# EasyEDA Pro project LCD1602 1601转接板.epro

# Board PCB1
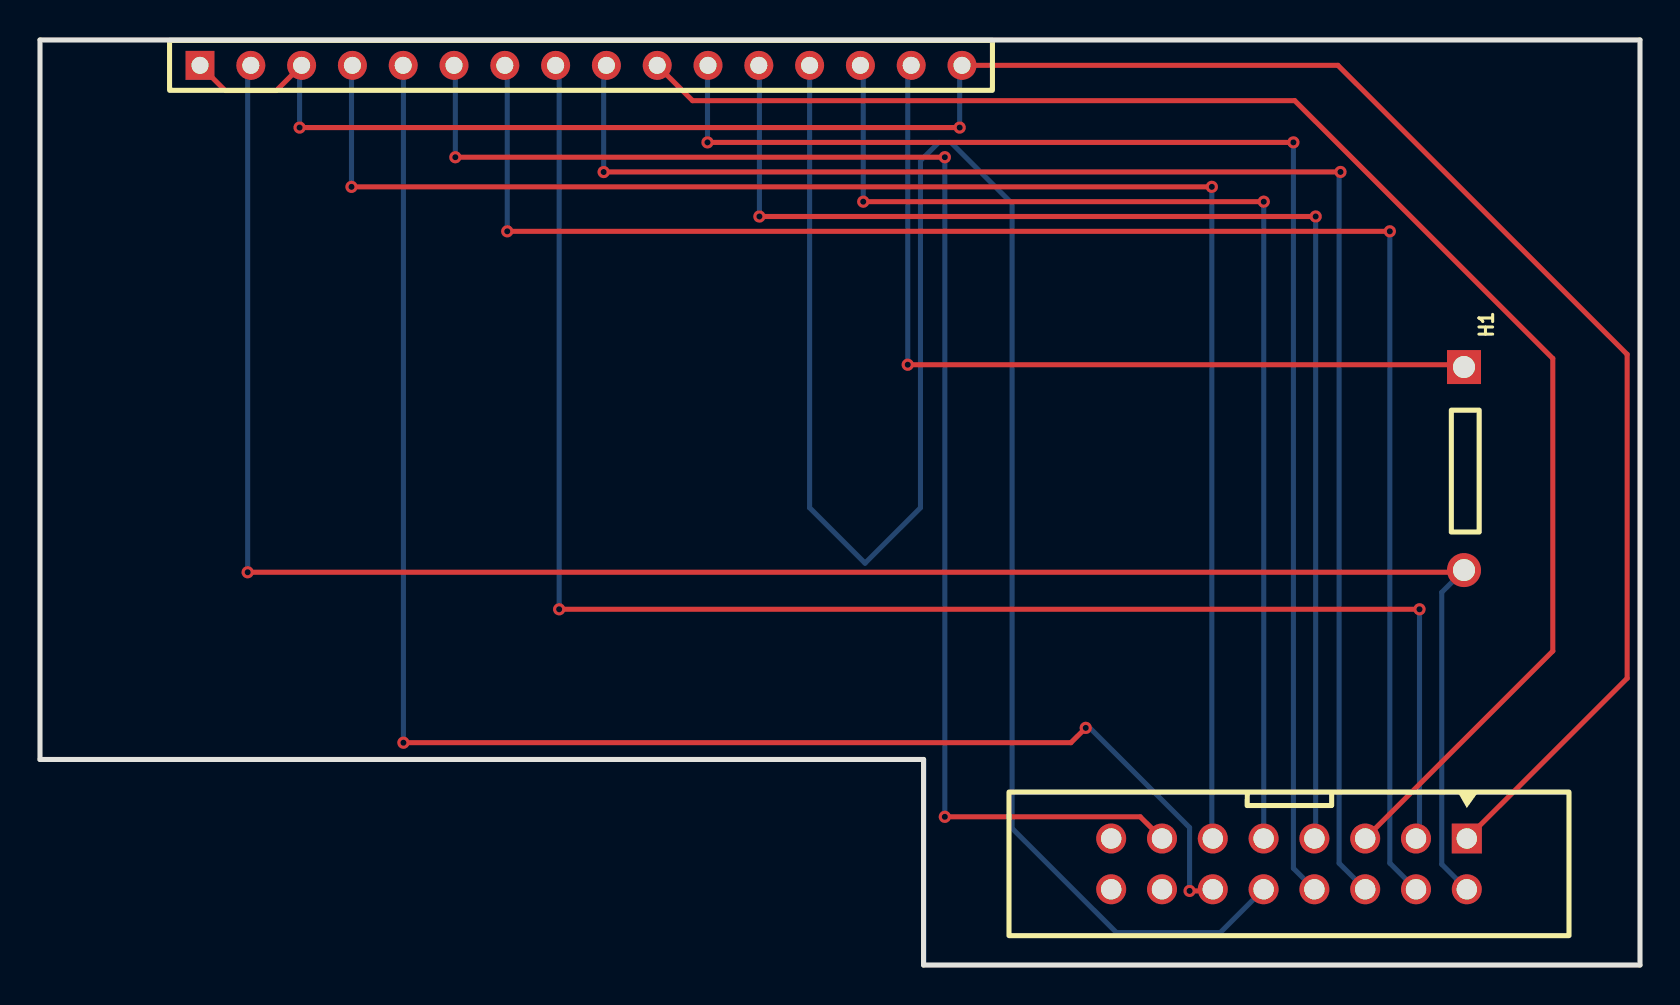
[diagram p0: board, top side]
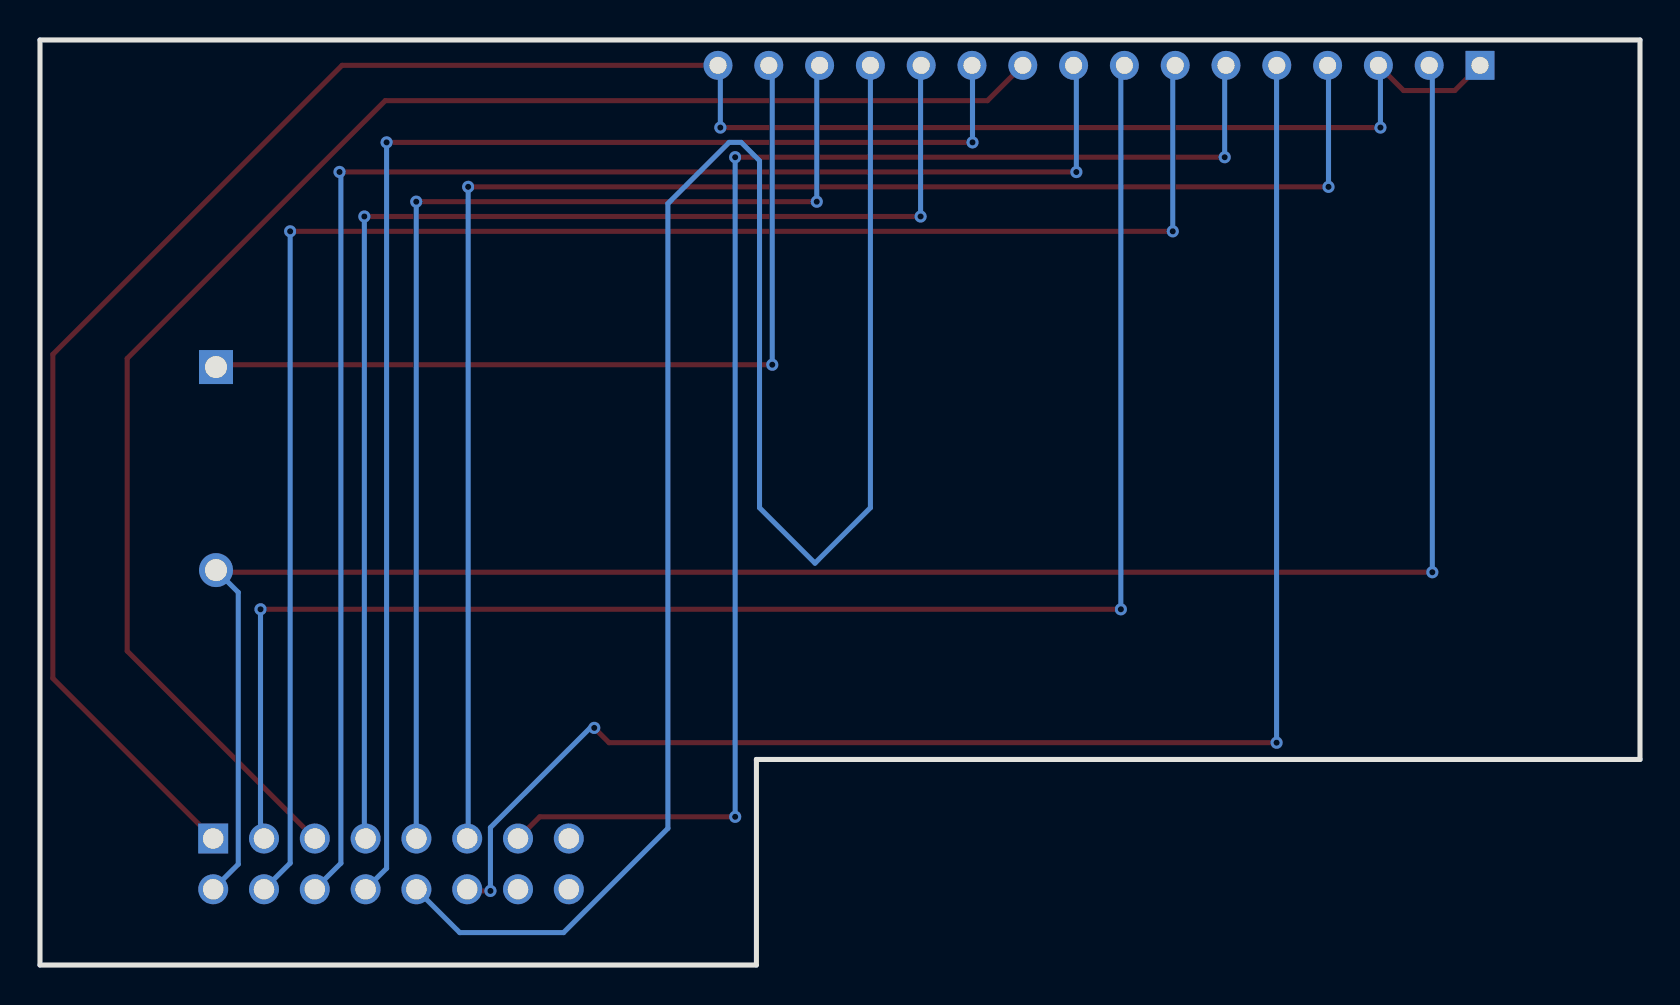
[diagram p1: board, bottom side, seen from below]

Outline 80 x 46.29 mm; copper layers: Top Layer, Bottom Layer. Coordinates in mm from the lower left corner of the outline.
Outline path: 0,46.29 0,10.29 44.18,10.29 44.18,0 80,0 80,46.29 0,46.29
Stack: Top Layer 0.035mm / Dielectric1 1.51mm FR4 er 4.5 / Bottom Layer 0.035mm

## Design rules (mm)
template: JLCPCB Capability(Two Layers Board)
spacing copperThickness1oz (default): track to track 0.102, other pairs 0.152 to 0.3
spacing copperThickness2oz: track to track 0.203, other pairs 0.152 to 0.3
track width copperThickness1oz (default): min 0.127, default 0.254, max 2.54
track width copperThickness2oz: min 0.203, default 0.254, max 2.54
differential pair differentialPair (default): width min 0.127, default 0.254, max 2.54; gap min 0.152, default 0.152
via viaSize (default): diameter min 0.5, default 0.61, max 10; hole min 0.3, default 0.305, max 6.3

## Placement (name value [footprint] x y rotation side)
H1  PZ254V-11-05P  [HDR-TH_5P-P2.54-V-M]  71.2 24.84 270 top
U1  HDGCPH-PZ01-16  [hdr-th_16p-p2.54-v-m_1]  27.05 45.02 0 top
U5  ZX-IDC2.54-2-8PZN  [idc-th_16p-p2.54_zx-idc2.54-2-8pzn]  62.45 5.06 180 top

## Footprints (pads in the part's own frame, mm; a bottom-side part is the same pattern mirrored in y, then rotated)
HDR-TH_5P-P2.54-V-M
  rect 1.7x1.7 hole 1.1: 1(-5.08,0)
  round 1.7 hole 1.1: 5(5.08,0)
hdr-th_16p-p2.54-v-m_1
  rect 1.45x1.45 hole 0.85: 1(-19.05,0)
  round 1.45 hole 0.85: 2(-16.51,0) 3(-13.97,0) 4(-11.43,0) 5(-8.89,0) 6(-6.35,0) 7(-3.81,0) 8(-1.27,0) 9(1.27,0) 10(3.81,0) 11(6.35,0) 12(8.89,0) 13(11.43,0) 14(13.97,0) 15(16.51,0) 16(19.05,0)
idc-th_16p-p2.54_zx-idc2.54-2-8pzn
  rect 1.5x1.5 hole 1.02: 1(-8.89,-1.27)
  round 1.5 hole 1.02: 2(-8.89,1.27) 3(-6.35,-1.27) 4(-6.35,1.27) 5(-3.81,-1.27) 6(-3.81,1.27) 7(-1.27,-1.27) 8(-1.27,1.27) 9(1.27,-1.27) 10(1.27,1.27) 11(3.81,-1.27) 12(3.81,1.27) 13(6.35,-1.27) 14(6.35,1.27) 15(8.89,-1.27) 16(8.89,1.27)

## Nets
33: H1.5 U1.2 U5.2
A: U5.16
A0: U1.7 U5.4
A1: U1.8 U5.3
A2: U1.9 U5.6
A3: U1.10 U5.5
A4: U1.11 U5.8
A5: U1.12 U5.7
A6: U1.13 U5.10
A7: U1.14 U5.9
AA: H1.1 U1.15
B12: U1.4 U5.11
B13: U1.5 U5.12
B14: U1.6 U5.13
G: U1.1 U1.3 U1.16 U5.1
K: U5.15
VO: U5.14

## Via types
v1: diameter 0.61, hole 0.305, Top Layer to Bottom Layer, 24 vias

## Routing (per net, layer and track width the routed paths; a pad name or vN(x,y) marks a point on that pad's centre or on a via; arc(x,y) is an arc through that point)
33: length 103.2
  Top Layer w0.254: H1.5 71.09,19.65 v1(10.38,19.65)
  Bottom Layer w0.254: U1.2 10.38,44.86 v1(10.38,19.65) ; H1.5 70.09,18.65 70.09,5.04 U5.2
A0: length 85.9
  Top Layer w0.254: v1(67.49,36.71) v1(23.36,36.71)
  Bottom Layer w0.254: v1(23.36,36.71) 23.36,44.89 U1.7 ; U5.4 67.49,5.1 v1(67.49,36.71)
A1: length 81.9
  Top Layer w0.254: v1(68.97,17.8) v1(25.96,17.8)
  Bottom Layer w0.254: v1(25.96,17.8) 25.96,44.84 U1.8 ; 68.8,6.33 68.97,6.51 v1(68.97,17.8)
A2: length 78.7
  Top Layer w0.254: v1(65.02,39.68) 28.19,39.68 v1(28.18,39.68)
  Bottom Layer w0.254: v1(28.18,39.68) 28.18,44.88 U1.9 ; v1(65.02,39.68) 64.96,39.61 64.96,5.09 U5.6
A3: length 78.8
  Top Layer w0.254: 66.26,6.33 75.64,15.71 75.64,30.35 62.74,43.25 32.63,43.25 U1.10
A4: length 71
  Top Layer w0.254: v1(62.67,41.16) v1(33.38,41.16)
  Bottom Layer w0.254: U1.11 33.38,44.99 v1(33.38,41.16) ; v1(62.67,41.16) 62.67,4.84 U5.8
A5: length 66.5
  Top Layer w0.254: v1(63.78,37.45) v1(35.97,37.45)
  Bottom Layer w0.254: v1(35.97,37.45) 35.97,44.99 U1.12 ; 63.72,6.33 63.78,6.39 v1(63.78,37.45)
A6: length 100.5
  Bottom Layer w0.254: U1.13 38.48,22.88 41.25,20.11 44.02,22.88 44.02,40.25 44.94,41.16 45.54,41.16 48.6,38.1 48.6,6.84 53.82,1.62 59.01,1.62 U5.10
A7: length 58.8
  Top Layer w0.254: v1(61.19,38.2) v1(41.16,38.2)
  Bottom Layer w0.254: U1.14 41.16,44.87 v1(41.16,38.2) ; 61.18,6.33 61.19,6.34 v1(61.19,38.2)
AA: length 42.9
  Top Layer w0.254: v1(43.39,30.04) 71.08,30.04 H1.1
  Bottom Layer w0.254: U1.15 43.39,44.84 v1(43.39,30.04)
B12: length 81.7
  Top Layer w0.254: v1(58.59,38.94) v1(15.58,38.94)
  Bottom Layer w0.254: v1(15.58,38.94) 15.58,44.97 U1.4 ; 58.64,6.33 58.59,6.38 v1(58.59,38.94)
B13: length 79.9
  Top Layer w0.254: v1(52.29,11.87) 51.55,11.12 v1(18.17,11.12) ; U5.12 58.56,3.71 v1(57.48,3.71)
  Bottom Layer w0.254: v1(18.17,11.12) 18.17,45.01 U1.5 ; v1(52.29,11.87) 52.49,11.87 57.48,6.88 v1(57.48,3.71)
B14: length 73.4
  Top Layer w0.254: 56.1,6.33 55.01,7.42 v1(45.24,7.42) ; v1(45.24,40.42) v1(20.77,40.42)
  Bottom Layer w0.254: U1.6 20.77,44.95 v1(20.77,40.42) ; v1(45.24,7.42) v1(45.24,40.42)
G: length 112.2
  Top Layer w0.254: U1.3 11.82,43.76 9.26,43.76 U1.1 ; U1.16 64.9,45.02 79.36,30.56 79.36,14.35 71.34,6.33 ; v1(45.98,41.9) v1(12.98,41.9)
  Bottom Layer w0.254: U1.3 12.98,44.92 v1(12.98,41.9) ; U1.16 45.98,44.9 v1(45.98,41.9)
